# Altium schematic sheet Power_Stage.SchDoc: Power
size 420 x 297 mm; Author: G.Kasprowicz; CompanyName: WUT ISE; DrawnBy: G.Kasprowicz; Organization: WUT ISE; Address1: PW ISE; Address2: Nowowiejska 15/19 00-665 Warsaw; Address3: gkasprow@gmail.com; DocumentNumber: 5; Revision: 2; SheetNumber: 5; SheetTotal: 7; ModifiedBy: -; CheckedDate: -; Title2: Stage; DivGrp: WUT ISE; Designer: G.Kasprowicz; ModifiedDate: -; ProjectName: Sensor Box
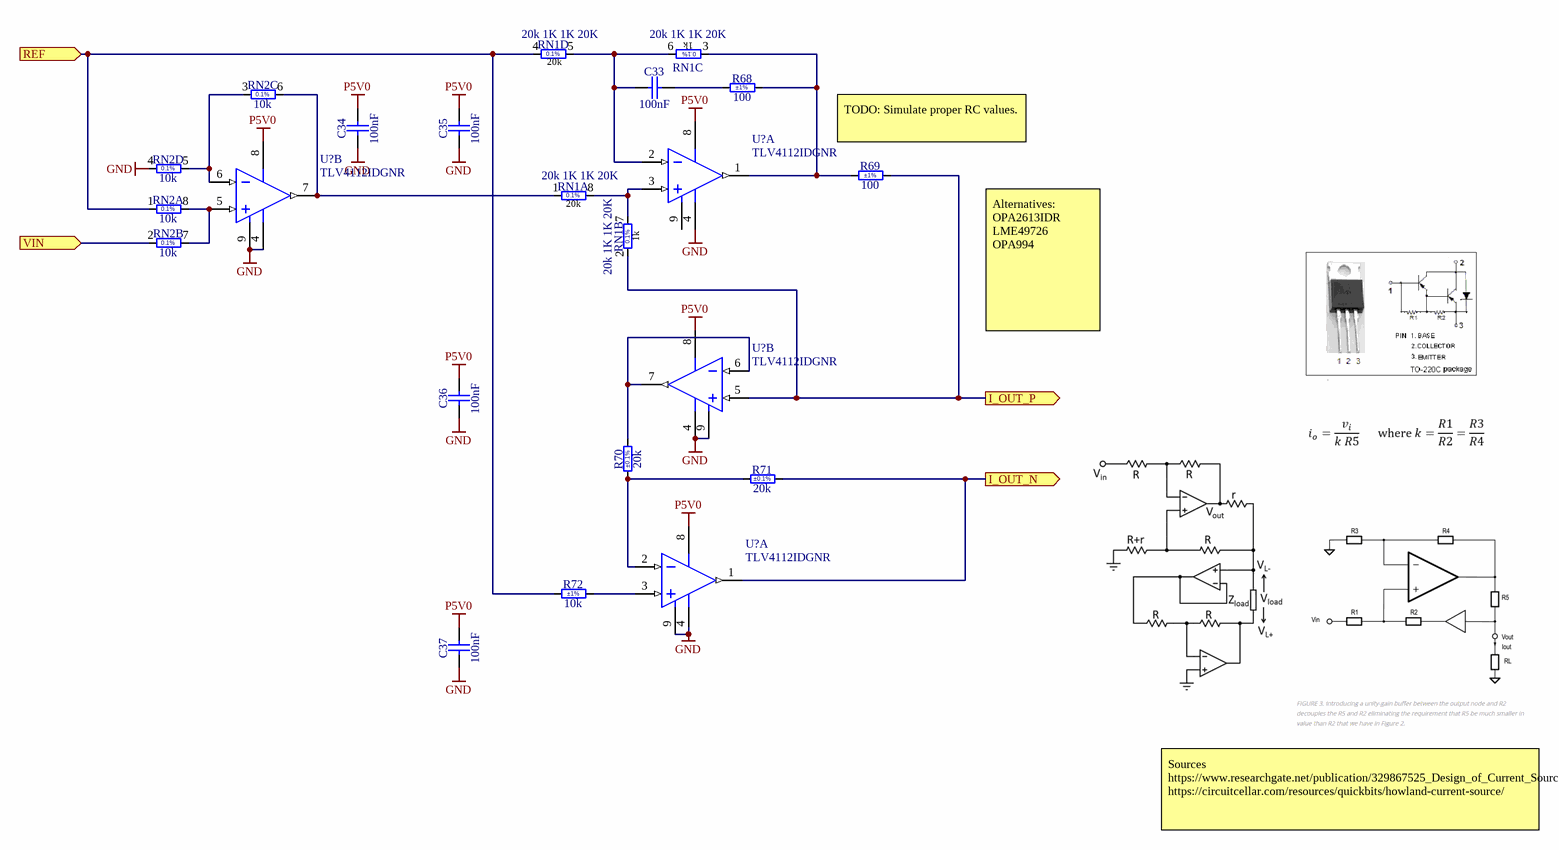
[diagram p0: Power_Stage.SchDoc]

## Parts
(Parts that share a designator on the sheet are numbered #1, #2 ... from top to bottom, then left to right.)
C33  100nF  [CAPC1005X55N]
C34  100nF  [CAPC1005X55N]
C35  100nF  [CAPC1005X55N]
C36  100nF  [CAPC1005X55N]
C37  100nF  [CAPC1005X55N]
R68  100  Tolerance: ±1%  [RESC1608X55N]
R69  100  Tolerance: ±1%  [RESC1608X55N]
R70  20k  Tolerance: ±0.1%  [RESC1608X55N]
R71  20k  Tolerance: ±0.1%  [RESC1608X55N]
R72  10k  Tolerance: ±1%  [RESC1005X40N]
RN1  20k 1K 1K 20K  [SOIC127P600X175-8N]  (parts A,B,C,D of 4)
RN2  10k  [SOIC127P600X175-8N]  (parts A,B,C,D of 4)
U?#1  TLV4112IDGNR  [DGN0008D_N]  (part A of 2)
U?#2  TLV4112IDGNR  [DGN0008D_N]  (part B of 2)
U?#3  TLV4112IDGNR  [DGN0008D_N]  (part B of 2)
U?#4  TLV4112IDGNR  [DGN0008D_N]  (part A of 2)

## Ports
I_OUT_N (out), I_OUT_P (out), REF (in), VIN (in)

## Nets
GND: C34.1 C35.1 C36.1 C37.1 RN2.4 U?#1.4(GND) U?#2.4(GND) U?#2.9(EP) U?#3.4(GND) U?#3.9(EP) U?#4.4(GND) U?#4.9(EP)
P5V0: C34.2 C35.2 C36.2 C37.2 U?#1.8(VDD+) U?#2.8(VDD+) U?#3.8(VDD+) U?#4.8(VDD+)
I_OUT_N: R71.2 U?#4.1(OUT1) ; port I_OUT_N
I_OUT_P: R69.2 RN1.2 U?#3.5(IN2+) ; port I_OUT_P
REF: R72.1 RN1.4 RN2.1 ; port REF
VIN: RN2.2 ; port VIN
NetC33_1: C33.1 RN1.5 RN1.6 U?#1.2(IN1-)
NetC33_2: C33.2 R68.1
NetR68_2: R68.2 R69.1 RN1.3 U?#1.1(OUT1)
NetR70_1: R70.1 R71.1 U?#4.2(IN1-)
NetR70_2: R70.2 U?#3.6(IN2-) U?#3.7(OUT2)
NetR72_2: R72.2 U?#4.3(IN1+)
NetRN1_1: RN1.1 RN2.6 U?#2.7(OUT2)
NetRN1_7: RN1.7 RN1.8 U?#1.3(IN1+)
NetRN2_3: RN2.3 RN2.5 U?#2.6(IN2-)
NetRN2_7: RN2.7 RN2.8 U?#2.5(IN2+)

Not connected (* = marked no-connect by the designer): U?#1 9(EP)

## Notes on the sheet
- (near R69) TODO: Simulate proper RC values.
- Alternatives:
  OPA2613IDR
  LME49726
  OPA994
- Sources https://www.researchgate.net/publication/329867525_Design_of_Current_Sources_for_Load_Common_Mode_Optimization/figures?lo=1
  https://circuitcellar.com/resources/quickbits/howland-current-source/
- Project/Equipment
- Document
- Designer
- Drawn by
- Check.by
- Copyright WUT ISE 2020.
  This documentation describes Open Hardware and is licensed under the CERN OHL v.1.2. You may redistribute and modify this documentation under the terms of the CERN OHL v.1.2. (http://ohwr.org/CERNOHL). This documentation is distributed WITHOUT ANY EXPRESS OR IMPLIED WARRANTY, INCLUDING OF MERCHANTABILITY, SATISFACTORY QUALITY AND FITNESS FOR A PARTICULAR PURPOSE. Please see the CERN OHL v.1.2 for applicable conditions.
- Contact
- File
- Last Mod.
- Print Date
- Sheet
- Size
- A3
- of
- Rev
- (in symbol RN_20K_1K_VISHAY_AORN20-1A, part A) 20k
- (in symbol RN_20K_1K_VISHAY_AORN20-1A, part B) 1k
- (in symbol RN_20K_1K_VISHAY_AORN20-1A, part C) 1k
- (in symbol RN_20K_1K_VISHAY_AORN20-1A, part D) 20k

## Library data of the parts
C33-C37 = CC0402_100NF_16V_10%_X5R: Non-polarised capacitor; Part Description: SMD Multilayer Chip Ceramic Capacitor; Manufacturer: GENERIC; Manufacturer1 Part Number: GRM155R61C104KA88D; Voltage: 16V; TC: X5R; Tolerance: ±10%; Part Number: CC0402_100NF_16V_10%_X5R; Component Kind: Standard; Component Type: Standard; Pin Count: 2; Value: 100nF; Status: None; Manufacturer Part Number: CC0402_100NF_16V_10%_X5R; Case: 0402; Mounted: Yes; Socket: No; SMD: Yes; Sense: No; Manufacturer1 Example: MURATA; Manufacturer1 ComponentHeight: 0.55mm; HelpURL: \\cern.ch\dfs\Applications\Altium\Datasheets\CC0402_X5R_MURATA_GRM.pdf; Author: CERN DEM JLC; CreateDate: 10.12.2013; LatestRevisionDate: 10.12.2013
R68 R69 = R0603_100R_1%_0.1W_100PPM: Resistor - 1%; Part Description: General Purpose Thick Film Chip Resistor; Manufacturer: GENERIC; Manufacturer1 Part Number: NRC06F4700TRF; Power: 0.1W; TC: ±100ppm/°C; PressFit: No; Part Number: R0603_100R_1%_0.1W_100PPM; Component Kind: Standard; Component Type: Standard; Pin Count: 2; Value: 100; Status: Preferred; Manufacturer Part Number: R0603_100R_1%_0.1W_100PPM; Case: 0603; Mounted: Yes; Sense: No; Socket: No; SMD: Yes; Manufacturer1 Example: NIC COMPONENT; Manufacturer1 ComponentHeight: 0.55mm; HelpURL: \\cern.ch\dfs\Applications\Altium\Datasheets\R0603_NIC_NRC.pdf; Author: CERN DEM JLC; CreateDate: 03.12.2007; LatestRevisionDate: 13.03.2008
R70 R71 = R0603_20K_0.1%_0.063W_10PPM: Resistor - 0.1%; Part Description: Thin Film Chip Resistor; Manufacturer: GENERIC; Manufacturer1 Part Number: RN73C1J20KBTDF; Power: 0.063W; TC: ±10ppm; PressFit: No; Part Number: R0603_20K_0.1%_0.063W_10PPM; Component Kind: Standard; Component Type: Standard; Pin Count: 2; Value: 20k; Status: Not Recommended; Manufacturer Part Number: R0603_20K_0.1%_0.063W_10PPM; Case: 0603; Mounted: Yes; Sense: No; Socket: No; SMD: Yes; Manufacturer1 Example: TYCO HOLSWORTHY; Manufacturer1 ComponentHeight: 0.5mm; HelpURL: \\cern.ch\dfs\Applications\Altium\Datasheets\R0603_Tyco_RN73.pdf; Author: CERN DEM JLC; CreateDate: 03.12.2007; LatestRevisionDate: 13.03.2008
R72 = R0402_10K_1%_0.0625W_100PPM: Resistor - 1%; Part Description: General Purpose Thick Film Chip Resistor; Manufacturer: GENERIC; Manufacturer1 Part Number: 232270671003L; TC: ±100ppm/°C; PressFit: No; Part Number: R0402_10K_1%_0.0625W_100PPM; Component Kind: Standard; Component Type: Standard; Pin Count: 2; Value: 10k; Status: Not Recommended; Power: 0.0625W; Manufacturer Part Number: R0402_10K_1%_0.0625W_100PPM; Case: 0402; Mounted: Yes; Sense: No; Socket: No; SMD: Yes; Manufacturer1 Example: YAGEO PHYCOMP; Manufacturer1 ComponentHeight: 0.4mm; HelpURL: \\cern.ch\dfs\Applications\Altium\Datasheets\R0402_Phycomp_RC0402.pdf; Author: CERN DEM JLC; CreateDate: 03.12.2007; LatestRevisionDate: 17.10.2012
RN1 = RN_20K_1K_VISHAY_AORN20-1A: DIL8 Resistor Network 4 Resistors 4xR 10k-1k-1k-10k 0.1%; Part Number: RN_20K_1K_VISHAY_AORN10-1A; Part Description: Dual-In-Line Thin Film Precision Automotive Resistors Network, (4 Isolated) - AORN Series; Manufacturer: VISHAY DALE; Power: 4x0.1W; TC: ±25ppm/°C; PressFit: No; Component Kind: Standard; Component Type: Standard; Pin Count: 8; Value: 20k 1K 1K 20K; Sense: No; Tolerance: 0.1%; Manufacturer Part Number: AORN20-1A; Case: SOIC8; Mounted: Yes; Socket: No; SMD: Yes; ComponentHeight: 1.73mm; HelpURL: \\cern.ch\dfs\Applications\Altium\Datasheets\RN_VISHAY_AORN.pdf; Author: GK; CreateDate: 20.02.2017; LatestRevisionDate: 15.01.2020
RN2 = RN_10K_VISHAY_AORN1002A: DIL8 Resistor Network 4 Isolated Resistor 0.1%; Part Description: Dual-In-Line Thin Film Precision Automotive Resistors Network, (4 Isolated) - AORN Series; Manufacturer: VISHAY DALE; Power: 4x0.1W; TC: ±25ppm/°C; PressFit: No; Part Number: RN_10K_VISHAY_AORN1002A; Component Kind: Standard; Component Type: Standard; Pin Count: 8; Value: 10k; Sense: No; Tolerance: 0.1%; Manufacturer Part Number: AORN1002A; Case: SOIC8; Mounted: Yes; Socket: No; SMD: Yes; ComponentHeight: 1.73mm; HelpURL: \\cern.ch\dfs\Applications\Altium\Datasheets\RN_VISHAY_AORN.pdf; Author: CERN DEM JLC; CreateDate: 20.02.2017; LatestRevisionDate: 03.05.2017
U?#1-U?#4 = CMP-0272-01268-3: High-Output-Drive Operational Amplifier, 2.5 to 6 V, -40 to 125 degC, 8-pin SOP (DGN8), Green (RoHS & no Sb/Br); Manufacturer: Texas Instruments; Total Supply Voltage(Min)(+5V is 5, +/-5V is 10): 2.5; Total Supply Voltage(Max)(+5V is 5, +/-5V is 10): 6; Offset Drift(Typ)(uV/C): 3; Sub Family: Low Supply Voltage Amplifier (<=2.7V), Precision Amplifier; Vio (25C)(Max)(mV): 3.5; Iq per channel(Max)(mA): 1; IIB(Max)(pA): 50; Slew Rate(Typ)(V/us): 1.57; Number of Channels: 2; CMRR(Min)(dB): 63; Vn at 1kHz(Typ)(nV/rtHz): 20; Eco-Plan: Green (RoHS & no Sb/Br); ComponentLink2URL: http://www.ti.com/general/docs/lit/getliterature.tsp?genericPartNumber=TLV4112&fileType=pdf; PartNumber: TLV4112IDGNR; PackageReference: DGN0008D; DatasheetVersion: SLOS289E; ComponentLink3Description: Package Specification; Code_JEDEC: MO-187; ComponentLink1Description: Manufacturer URL; ComponentLink1URL: http://www.ti.com/; PackageDescription: 8-Pin Plastic Small Outline, Body 3 x 3 mm, Pitch 0.65 mm; ComponentLink3URL: http://www.ti.com/litv/pdf/mpds046e; ComponentLink2Description: Datasheet; PackageVersion: 4073271/F, 05/2011; Mounting Technology: Surface Mount